# Altium project FinalProjectCO2038.PrjPcb
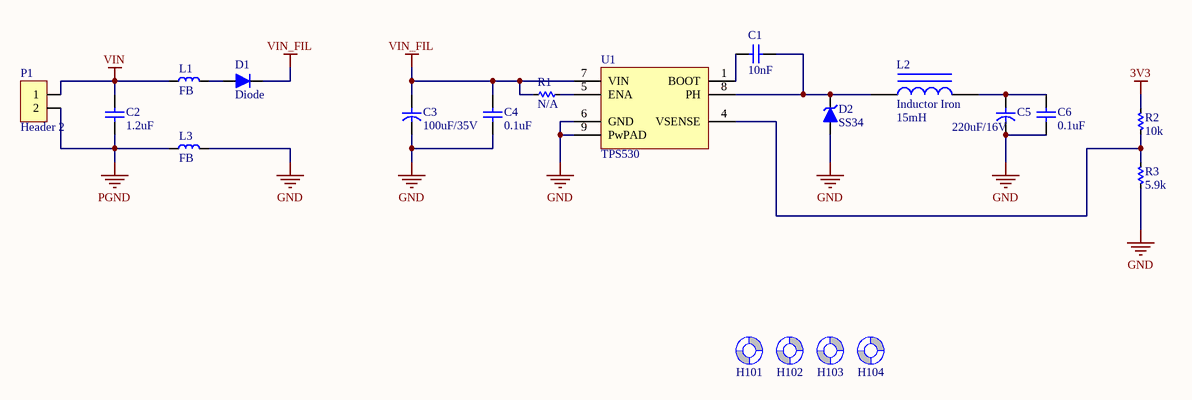
[diagram p0: 3.3VRegulator.SchDoc]
6 sheets, 63 parts. Net scope: global (net labels, ports and power ports of the same name join across sheets).
Board files: BigProjectPCB.PcbDoc, PCB2.0.PcbDoc
Sheets:
  3.3VRegulator.SchDoc
  ESP32-WROM-32.SchDoc
  SlideSwitchMCU.SchDoc
  CurrentSensor.SchDoc
  RS-485.SchDoc
  HighCurrentLED.SchDoc

## Sheet 3.3VRegulator.SchDoc
size A

### Parts
C1  10nF  [C 0805]
C2  1.2uF  [C 0805]
C3  100uF/35V  [C SMD ALU (B)]
C4  0.1uF  [C 0805]
C5  220uF/16V  [C SMD ALU (B)]
C6  0.1uF  [C 0805]
D1  Diode  [SOD323]
D2  SS34  [DO-214AC (SMA)]
H101  Screw Hole  [SCREW/3.2/7.0/M]  (value not drawn)  (no BOM)
H102  Screw Hole  [SCREW/3.2/7.0/M]  (value not drawn)  (no BOM)
H103  Screw Hole  [SCREW/3.2/7.0/M]  (value not drawn)  (no BOM)
H104  Screw Hole  [SCREW/3.2/7.0/M]  (value not drawn)  (no BOM)
L1  FB  [L 0805 (2012)]
L2  Inductor Iron  value 15mH  [AXIAL-0.9]
L3  FB  [L 0805 (2012)]
P1  Header 2  [HDR/Header/2/BOX/RED]
R1  N/A  [RES-SMD-0201]
R2  10k  [RES-SMD-0201]
R3  5.9k  [RES-SMD-0201]
U1  TPS530  [SOIC-8 EP]

### Nets
3V3: R2.2
GND: C3.2 C4.2 C5.2 C6.2 D2.1(A) L3.2 R3.1 U1.6(GND) U1.9(PwPAD)
PGND: C2.2 L3.1 P1.2
VIN: C2.1 L1.1 P1.1
VIN_FIL: C3.1 C4.1 D1.2(K) R1.2 U1.7(VIN)
NetC1_1: C1.1 U1.1(BOOT)
NetC1_2: C1.2 D2.2(K) L2.1 U1.8(PH)
NetC5_1: C5.1 C6.1 L2.2
NetD1_1: D1.1(A) L1.2
NetR1_1: R1.1 U1.5(ENA)
NetR2_1: R2.1 R3.2 U1.4(VSENSE)

Not connected (* = marked no-connect by the designer): H101 1(Screw); H102 1(Screw); H103 1(Screw); H104 1(Screw)

### Library data of the parts
C1 C2 C4 C6 = Capacitor NP: Capacitor non-pol
C3 C5 = Capacitor: Capacitor pol
D1 = Diode: Default Diode
D2 = Diode Zener: Zener Diode
L1 L3 = Inductor
L2 = Inductor Iron: Magnetic-Core Inductor; Published: 24-Mar-1999; LatestRevisionDate: 17-Jul-2002; LatestRevisionNote: Re-released for DXP Platform.; PackageReference: AXIAL-0.9; Publisher: Altium Limited; PackageDescription: Axial Device, Thru-Hole; 2 Leads; 0.9 in Pin Spacing
P1 = Header 2: Header, 2-Pin
R1-R3 = Res-SMD: Resistor; Manufacturer: Generic Components; Class: Passive; Published: 08/06/2000; Publisher: Altium Hobart Technology Centre
U1 = TPS54xx: 3/5A, Wide input range, Step-down SWIFT DC-DC Converter
H101-H104 = Screw Hole: TYPE: NO-BOM; UNIT PRICE: 0

## Sheet ESP32-WROM-32.SchDoc
size A
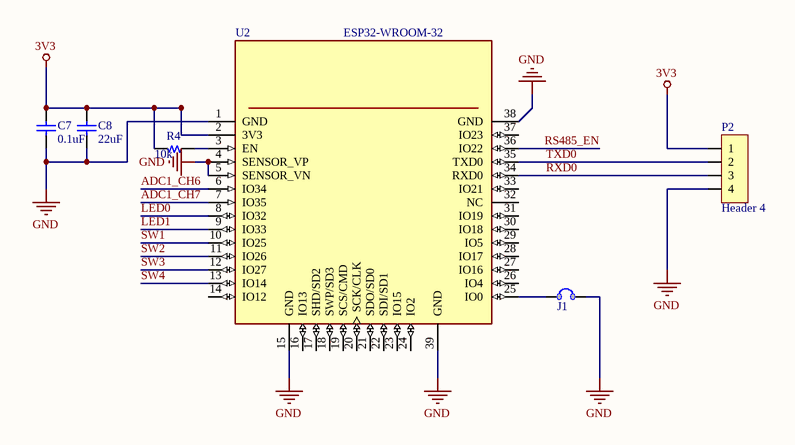
[diagram p1: ESP32-WROM-32.SchDoc]

### Parts
C7  0.1uF  [C 0805]
C8  22uF  [C 0805]
J1  BOOT  [JUMP/2/Open]  (value not drawn)  (no BOM)
P2  Header 4  [HDR/Header/4/BOX/WHITE]
R4  10k  [R 0805]
U2  ESP32-WROOM-32  [MODULE_ESP32-WROOM-32]

### Nets
3V3: C7.1 C8.1 P2.1 R4.2 U2.2(3V3)
GND: C7.2 C8.2 J1.2 P2.4 U2.1(GND) U2.4(SENSOR_VP) U2.5(SENSOR_VN) U2.15(GND) U2.38(GND) U2.39(GND)
ADC1_CH6: U2.6(IO34)
ADC1_CH7: U2.7(IO35)  [project net 3V3/2]
LED0: U2.8(IO32)
LED1: U2.9(IO33)
RS485_EN: U2.36(IO22)
RXD0: P2.3 U2.34(RXD0)
SW1: U2.10(IO25)
SW2: U2.11(IO26)
SW3: U2.12(IO27)
SW4: U2.13(IO14)
TXD0: P2.2 U2.35(TXD0)
NetJ1_1: J1.1 U2.25(IO0)
NetR4_1: R4.1 U2.3(EN)

Not connected (* = marked no-connect by the designer): U2 14(IO12) 16(IO13) 17(SHD/SD2) 18(SWP/SD3) 19(SCS/CMD) 20(SCK/CLK) 21(SDO/SD0) 22(SDI/SD1) 23(IO15) 24(IO2) 26(IO4) 27(IO16) 28(IO17) 29(IO5) 30(IO18) 31(IO19) 32(NC) 33(IO21) 37(IO23)

### Library data of the parts
C7 C8 = Capacitor NP: Capacitor non-pol
J1 = JUMP 2
P2 = Header 4: Header, 4-Pin
R4 = Resistor
U2 = ESP32-WROOM-32: Bluetooth, WiFi 802.11b/g/n, Bluetooth v4.2 + EDR, Class 1, 2 and 3 Transceiver Module 2.4GHz ~ 2.5GHz Integrated, Trace Surface Mount; MF: Espressif Systems; MP: ESP32-WROOM-32D; Price: None; Package: Module Espressif Systems; Availability: Unavailable; SnapEDA_Link: https://www.snapeda.com/parts/ESP32-WROOM-32D/Espressif%20Systems/view-part/2768115/?ref=snap; Value: *

## Sheet SlideSwitchMCU.SchDoc
size A
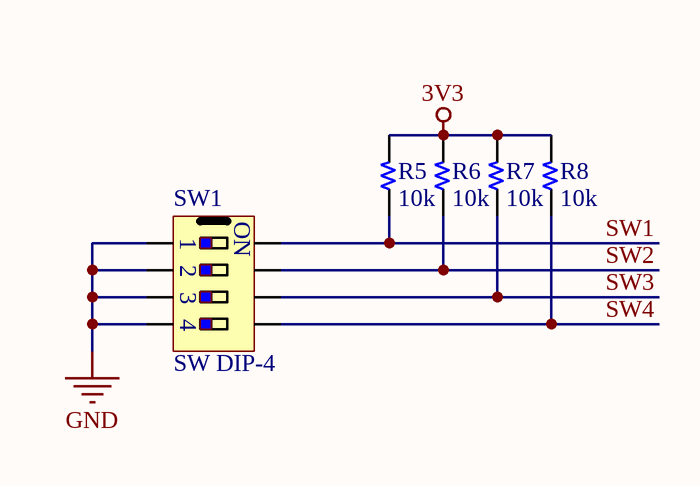
[diagram p2: SlideSwitchMCU.SchDoc]

### Parts
R5  10k  [R 0805]
R6  10k  [R 0805]
R7  10k  [R 0805]
R8  10k  [R 0805]
SW1  SW DIP-4  [SW/DIP4]

### Nets
3V3: R5.2 R6.2 R7.2 R8.2
GND: SW1.1 SW1.2 SW1.3 SW1.4
SW1: R5.1 SW1.8
SW2: R6.1 SW1.7
SW3: R7.1 SW1.6
SW4: R8.1 SW1.5

### Notes on the sheet
- (in symbol SW DIP-4) ON

### Library data of the parts
R5-R8 = Resistor

## Sheet CurrentSensor.SchDoc
size A
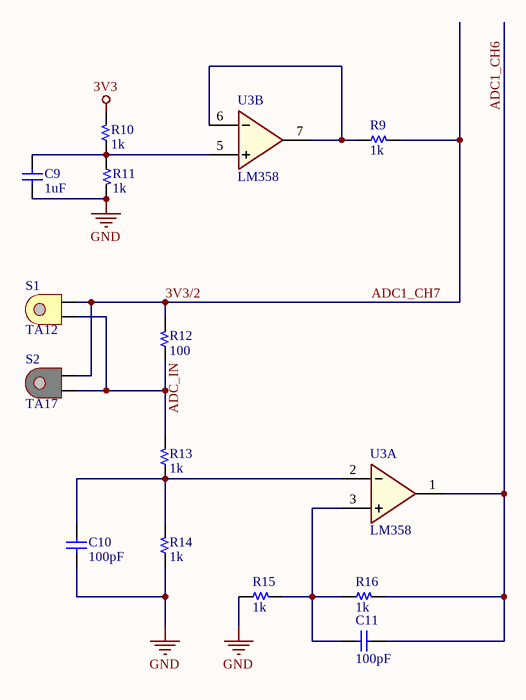
[diagram p3: CurrentSensor.SchDoc]

### Parts
C9  1uF  [C 0805]
C10  100pF  [C 0805]
C11  100pF  [C 0805]
R9  1k  [R 0805]
R10  1k  [R 0805]
R11  1k  [R 0805]
R12  100  [R 0805]
R13  1k  [R 0805]
R14  1k  [R 0805]
R15  1k  [R 0805]
R16  1k  [R 0805]
S1  TA12  [TA12]
S2  TA17  [TA17]
U3  LM358  [SOIC-8]  (parts A,B of 2)

### Nets
3V3: R10.2
GND: C9.1 C10.2 R11.2 R14.1 R15.1 U3.4(GND)
VCC: U3.8(VCC)
3V3/2: R9.2 R12.2 S1.2 S2.2  [also labelled ADC1_CH7]
ADC1_CH6: C11.2 R16.2 U3.1(OutA)
ADC_IN: R12.1 R13.2 S1.1 S2.1
NetC9_2: C9.2 R10.1 R11.1 U3.5(B+)
NetC10_1: C10.1 R13.1 R14.2 U3.2(A-)
NetC11_1: C11.1 R15.2 R16.1 U3.3(A+)
NetR9_1: R9.1 U3.6(B-) U3.7(OutB)

### Library data of the parts
C9-C11 = Capacitor NP: Capacitor non-pol
R9-R16 = Resistor
U3 = LM358: Low Power Dual Operational Amplifiers

## Sheet RS-485.SchDoc
size A
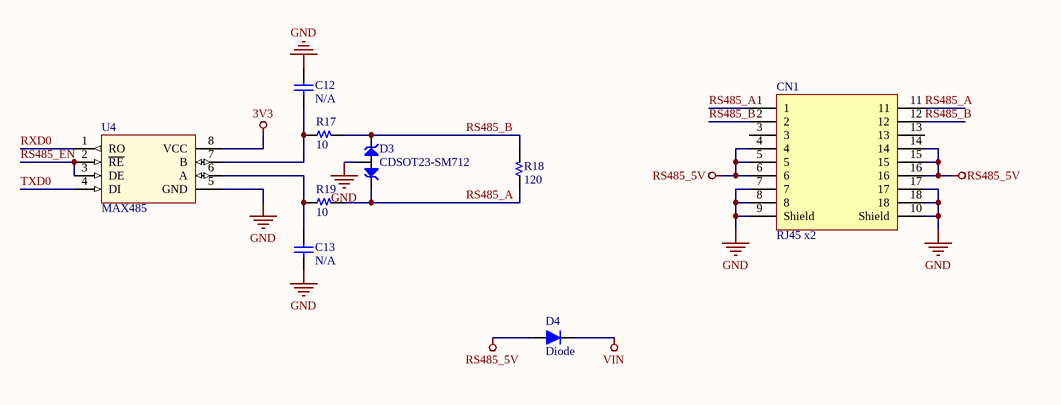
[diagram p4: RS-485.SchDoc]

### Parts
C12  N/A  [C 0805]
C13  N/A  [C 0805]
CN1  RJ45 x2  [CONN/RJ45/x2]
D3  CDSOT23-SM712  [SOT-23]
D4  Diode  [SOD323]
R17  10  [R 0805]
R18  120  [R 0805]
R19  10  [R 0805]
U4  MAX485  [SOIC-8]

### Nets
3V3: U4.8(VCC)
GND: C12.1 C13.2 CN1.7 CN1.8 CN1.9(Shield) CN1.10(Shield) CN1.17 CN1.18 D3.3(COM) U4.5(GND)
RS485_5V: CN1.4 CN1.5 CN1.6 CN1.14 CN1.15 CN1.16 D4.1(A)
VIN: D4.2(K)
RS485_A: CN1.1 CN1.11 D3.1(IO1) R18.1 R19.2
RS485_B: CN1.2 CN1.12 D3.2(IO2) R17.2 R18.2
RS485_EN: U4.2(~{RE}) U4.3(DE)
RXD0: U4.1(RO)
TXD0: U4.4(DI)
NetC12_2: C12.2 R17.1 U4.7(B)
NetC13_1: C13.1 R19.1 U4.6(A)

Not connected (* = marked no-connect by the designer): CN1 3 13

### Library data of the parts
C12 C13 = Capacitor NP: Capacitor non-pol
CN1 = CON RJ45 x2: Connector RJ45 X2
D3 = CDSOT23-SM712: TVS DIODE 7V/12V 14V/26V SOT23-3
D4 = Diode: Default Diode
R17-R19 = Resistor
U4 = MAX485: Low-Power, Slew-Rate-Limited  RS-485/RS-422 Transceivers

## Sheet HighCurrentLED.SchDoc
size A
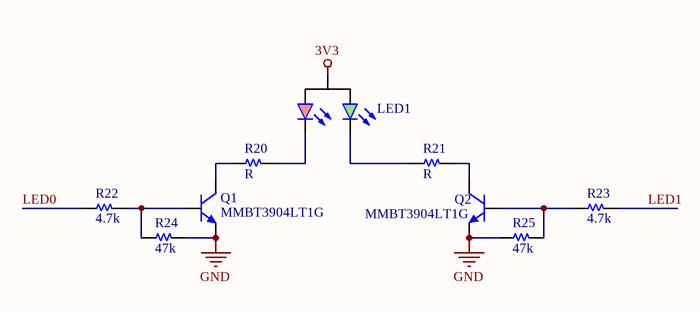
[diagram p5: HighCurrentLED.SchDoc]

### Parts
LED1  Led 3pin 2color  [LED 3PIN 2COLOR 5MM]  (value not drawn)
Q1  MMBT3904LT1G  [SOT-23]
Q2  MMBT3904LT1G  [SOT-23]
R20  R  [R 0805]
R21  R  [R 0805]
R22  4.7k  [R 0805]
R23  4.7k  [R 0805]
R24  47k  [R 0805]
R25  47k  [R 0805]

### Nets
3V3: LED1.2(A)
GND: Q1.2(E) Q2.2(E) R24.2 R25.1
LED0: R22.1
LED1: R23.2
NetLED1_1: LED1.1(RK) R20.2
NetLED1_3: LED1.3(YK) R21.1
NetQ1_1: Q1.1(B) R22.2 R24.1
NetQ1_3: Q1.3(C) R20.1
NetQ2_1: Q2.1(B) R23.1 R25.2
NetQ2_3: Q2.3(C) R21.2

### Library data of the parts
LED1 = Led 3pin 2color: Typical LED 3-pin 2-color
Q1 Q2 = Transistor NPN: NPN Bipolar Transistor
R20-R25 = Resistor

## Nets that join several sheets
3V3: 3.3VRegulator (R2.2), ESP32-WROM-32 (5 pins), SlideSwitchMCU (R5.2 R6.2 R7.2 R8.2), CurrentSensor (R10.2), RS-485 (U4.8), HighCurrentLED (LED1.2)
GND: 3.3VRegulator (9 pins), ESP32-WROM-32 (10 pins), SlideSwitchMCU (SW1.1 SW1.2 SW1.3 SW1.4), CurrentSensor (6 pins), RS-485 (10 pins), HighCurrentLED (Q1.2 Q2.2 R24.2 R25.1)
VIN: 3.3VRegulator (C2.1 L1.1 P1.1), RS-485 (D4.2)
3V3/2: ESP32-WROM-32 (U2.7), CurrentSensor (R9.2 R12.2 S1.2 S2.2)
ADC1_CH6: ESP32-WROM-32 (U2.6), CurrentSensor (C11.2 R16.2 U3.1)
LED0: ESP32-WROM-32 (U2.8), HighCurrentLED (R22.1)
LED1: ESP32-WROM-32 (U2.9), HighCurrentLED (R23.2)
RS485_EN: ESP32-WROM-32 (U2.36), RS-485 (U4.2 U4.3)
RXD0: ESP32-WROM-32 (P2.3 U2.34), RS-485 (U4.1)
SW1: ESP32-WROM-32 (U2.10), SlideSwitchMCU (R5.1 SW1.8)
SW2: ESP32-WROM-32 (U2.11), SlideSwitchMCU (R6.1 SW1.7)
SW3: ESP32-WROM-32 (U2.12), SlideSwitchMCU (R7.1 SW1.6)
SW4: ESP32-WROM-32 (U2.13), SlideSwitchMCU (R8.1 SW1.5)
TXD0: ESP32-WROM-32 (P2.2 U2.35), RS-485 (U4.4)